# EAGLE design rfidLock3 (EAGLE 7.5.0)
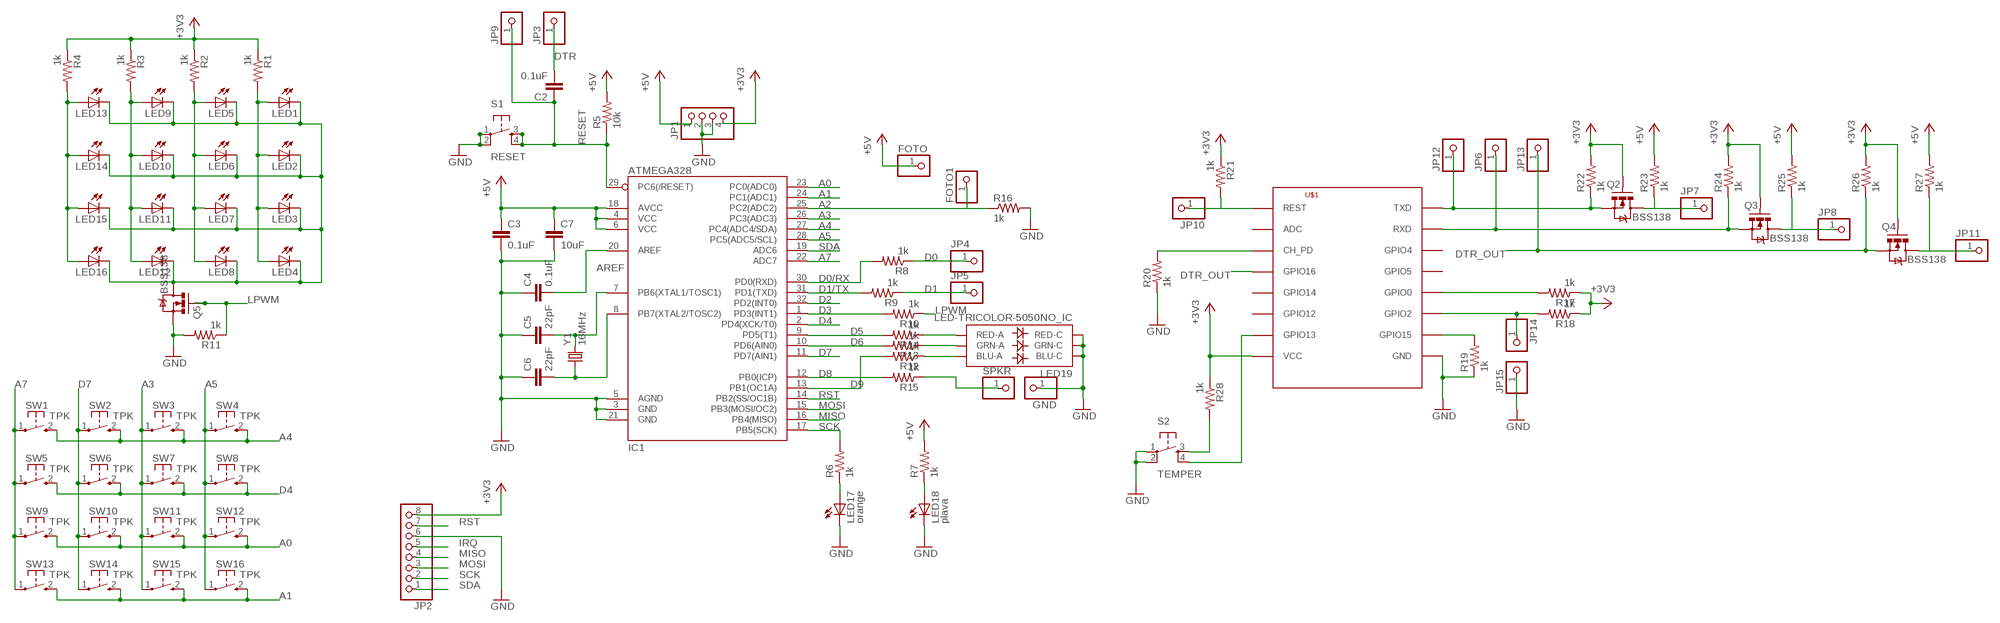
[diagram p0: schematic, sheet 1]

## Parts
C2  0.1uF  CAP0805  [0805]
C3  0.1uF  CAP0805  [0805]
C4  0.1uF  CAP0805  [0805]
C5  22pF  CAP0805  [0805]
C6  22pF  CAP0805  [0805]
C7  10uF  C-EUC3216  [C3216]
FOTO  PINHD-1X1  [1X01]
FOTO1  PINHD-1X1  [1X01]
GND  PINHD-1X1  [1X01]
IC1  ATMEGA328  ATMEGA168  [TQFP32-08]
JP1  PINHD-1X4  [1X04]
JP2  PINHD-1X8  [1X08]
JP3  PINHD-1X1  [1X01]
JP4  PINHD-1X1  [1X01]
JP5  PINHD-1X1  [1X01]
JP6  PINHD-1X1  [1X01]
JP7  PINHD-1X1  [1X01]
JP8  PINHD-1X1  [1X01]
JP9  PINHD-1X1  [1X01]
JP10  PINHD-1X1  [1X01]
JP11  PINHD-1X1  [1X01]
JP12  PINHD-1X1  [1X01]
JP13  PINHD-1X1  [1X01]
JP14  PINHD-1X1  [1X01]
JP15  PINHD-1X1  [1X01]
LED1  LED_E  [LED_1206]
LED2  LED_E  [LED_1206]
LED3  LED_E  [LED_1206]
LED4  LED_E  [LED_1206]
LED5  LED_E  [LED_1206]
LED6  LED_E  [LED_1206]
LED7  LED_E  [LED_1206]
LED8  LED_E  [LED_1206]
LED9  LED_E  [LED_1206]
LED10  LED_E  [LED_1206]
LED11  LED_E  [LED_1206]
LED12  LED_E  [LED_1206]
LED13  LED_E  [LED_1206]
LED14  LED_E  [LED_1206]
LED15  LED_E  [LED_1206]
LED16  LED_E  [LED_1206]
LED17  orange  LEDCHIP-LED0805  [CHIP-LED0805]
LED18  plava  LEDCHIP-LED0805  [CHIP-LED0805]
LED19  LED-TRICOLOR-5050NO_IC  [LED-TRICOLOR-5050]
Q2  BSS138  MOSFET-NCHANNELSMD  [SOT23-3]
Q3  BSS138  MOSFET-NCHANNELSMD  [SOT23-3]
Q4  BSS138  MOSFET-NCHANNELSMD  [SOT23-3]
Q5  BSS138  MOSFET-NCHANNELSMD  [SOT23-3]
R1  1k  RESISTOR0805-RES  [0805]
R2  1k  RESISTOR0805-RES  [0805]
R3  1k  RESISTOR0805-RES  [0805]
R4  1k  RESISTOR0805-RES  [0805]
R5  10k  RESISTOR0805-RES  [0805]
R6  1k  RESISTOR0805-RES  [0805]
R7  1k  RESISTOR0805-RES  [0805]
R8  1k  RESISTOR0805-RES  [0805]
R9  1k  RESISTOR0805-RES  [0805]
R10  1k  RESISTOR0805-RES  [0805]
R11  1k  RESISTOR0805-RES  [0805]
R12  1k  RESISTOR0805-RES  [0805]
R13  1k  RESISTOR0805-RES  [0805]
R14  1k  RESISTOR0805-RES  [0805]
R15  1k  RESISTOR0805-RES  [0805]
R16  1k  RESISTOR0805-RES  [0805]
R17  1k  RESISTOR0805-RES  [0805]
R18  1k  RESISTOR0805-RES  [0805]
R19  1k  RESISTOR0805-RES  [0805]
R20  1k  RESISTOR0805-RES  [0805]
R21  1k  RESISTOR0805-RES  [0805]
R22  1k  RESISTOR0805-RES  [0805]
R23  1k  RESISTOR0805-RES  [0805]
R24  1k  RESISTOR0805-RES  [0805]
R25  1k  RESISTOR0805-RES  [0805]
R26  1k  RESISTOR0805-RES  [0805]
R27  1k  RESISTOR0805-RES  [0805]
R28  1k  RESISTOR0805-RES  [0805]
S1  RESET  TAC_SWITCHSMD  [TACTILE_SWITCH_SMD]
S2  TEMPER  TAC_SWITCHSMD  [TACTILE_SWITCH_SMD]
SPKR  PINHD-1X1  [1X01]
SW1  TPK  KSS-2EG4430  [KSS-2EG4430]
SW2  TPK  KSS-2EG4430  [KSS-2EG4430]
SW3  TPK  KSS-2EG4430  [KSS-2EG4430]
SW4  TPK  KSS-2EG4430  [KSS-2EG4430]
SW5  TPK  KSS-2EG4430  [KSS-2EG4430]
SW6  TPK  KSS-2EG4430  [KSS-2EG4430]
SW7  TPK  KSS-2EG4430  [KSS-2EG4430]
SW8  TPK  KSS-2EG4430  [KSS-2EG4430]
SW9  TPK  KSS-2EG4430  [KSS-2EG4430]
SW10  TPK  KSS-2EG4430  [KSS-2EG4430]
SW11  TPK  KSS-2EG4430  [KSS-2EG4430]
SW12  TPK  KSS-2EG4430  [KSS-2EG4430]
SW13  TPK  KSS-2EG4430  [KSS-2EG4430]
SW14  TPK  KSS-2EG4430  [KSS-2EG4430]
SW15  TPK  KSS-2EG4430  [KSS-2EG4430]
SW16  TPK  KSS-2EG4430  [KSS-2EG4430]
U$1  ESP8266-07  [ESP-07]
Y1  16MHz  CRYSTAL5X3  [CRYSTAL-SMD-5X3]

## Nets
+3V3: JP1.4 JP2.8 Q2.1(G) Q3.1(G) Q4.1(G) R1.1 R2.1 R3.1 R4.1 R17.1 R18.1 R21.1 R22.2 R24.2 R26.2 R28.1 U$1.VCC
+5V: C3.1 C7.1 FOTO.1 IC1.4(VCC) IC1.6(VCC) IC1.18(AVCC) JP1.1 R5.2 R7.2 R23.2 R25.2 R27.2
A0: IC1.23(PC0(ADC0)) SW9.2(S) SW10.2(S) SW11.2(S) SW12.2(S)
A1: IC1.24(PC1(ADC1)) SW13.2(S) SW14.2(S) SW15.2(S) SW16.2(S)
A2: FOTO1.1 IC1.25(PC2(ADC2)) R16.1
A3: IC1.26(PC3(ADC3)) SW3.1(P) SW7.1(P) SW11.1(P) SW15.1(P)
A4: IC1.27(PC4(ADC4/SDA)) SW1.2(S) SW2.2(S) SW3.2(S) SW4.2(S)
A5: IC1.28(PC5(ADC5/SCL)) SW4.1(P) SW8.1(P) SW12.1(P) SW16.1(P)
A7: IC1.22(ADC7) SW1.1(P) SW5.1(P) SW9.1(P) SW13.1(P)
AREF: C4.2 IC1.20(AREF)
CRYSTAL1: C5.2 IC1.7(PB6(XTAL1/TOSC1)) Y1.3
CRYSTAL2: C6.2 IC1.8(PB7(XTAL2/TOSC2)) Y1.1
D0: JP4.1 R8.1
D0/RX: IC1.30(PD0(RXD)) R8.2
D1: JP5.1 R9.1
D1/TX: IC1.31(PD1(TXD)) R9.2
D2: IC1.32(PD2(INT0))
D3: IC1.1(PD3(INT1)) R10.2
D4: IC1.2(PD4(XCK/T0)) SW5.2(S) SW6.2(S) SW7.2(S) SW8.2(S)
D5: IC1.9(PD5(T1)) R14.2
D6: IC1.10(PD6(AIN0)) R13.2
D7: IC1.11(PD7(AIN1)) SW2.1(P) SW6.1(P) SW10.1(P) SW14.1(P)
D8: IC1.12(PB0(ICP)) R15.2
D9: IC1.13(PB1(OC1A)) R12.2
DTR: C2.2 JP3.1
DTR_OUT: JP13.1 Q4.2(S) R26.1 U$1.GPIO16
GND: C3.2 C4.1 C5.1 C6.1 C7.2 GND.1 IC1.3(GND) IC1.5(AGND) IC1.21(GND) JP1.2 JP1.3 JP2.6 JP15.1 LED17.C LED18.C LED19.4(BLU-C) LED19.5(RED-C) LED19.6(GRN-C) Q5.2(S) R11.2 R16.2 R19.1 R20.1 S1.1 S1.2 S2.1 S2.2 U$1.GND
HV1: JP7.1 Q2.3(D) R23.1
HV2: JP8.1 Q3.3(D) R25.1
HV3: JP11.1 Q4.3(D) R27.1
IRQ: JP2.5
LGND: LED1.C LED2.C LED3.C LED4.C LED5.C LED6.C LED7.C LED8.C LED9.C LED10.C LED11.C LED12.C LED13.C LED14.C LED15.C LED16.C Q5.3(D)
LPWM: Q5.1(G) R10.1 R11.1
LV1: JP12.1 Q2.2(S) R22.1 U$1.TXD
LV2: JP6.1 Q3.2(S) R24.1 U$1.RXD
MISO: IC1.16(PB4(MISO)) JP2.4
MOSI: IC1.15(PB3(MOSI/OC2)) JP2.3
N$1: LED9.A LED10.A LED11.A LED12.A R3.2
N$2: LED13.A LED14.A LED15.A LED16.A R4.2
N$3: LED5.A LED6.A LED7.A LED8.A R2.2
N$4: LED1.A LED2.A LED3.A LED4.A R1.2
N$5: LED17.A R6.1
N$6: LED19.1(GRN-A) R13.1
N$7: LED18.A R7.1
N$8: LED19.2(RED-A) R14.1
N$9: LED19.3(BLU-A) R12.1
N$10: R15.1 SPKR.1
N$11: R17.2 U$1.GPIO0
N$12: JP14.1 R18.2 U$1.GPIO2
N$13: R19.2 U$1.GPIO15
N$14: R20.2 U$1.CH_PD
N$15: JP10.1 R21.2 U$1.REST
N$20: R28.2 S2.3
N$21: S2.4 U$1.GPIO13
RESET: C2.1 IC1.29(PC6(/RESET)) JP9.1 R5.1 S1.3 S1.4
RST: IC1.14(PB2(SS/OC1B)) JP2.7
SCK: IC1.17(PB5(SCK)) JP2.2 R6.2
SDA: IC1.19(ADC6) JP2.1
Unconnected: U$1.ADC U$1.GPIO4 U$1.GPIO5 U$1.GPIO12 U$1.GPIO14

## Library data of the parts
C2-C6 = SparkFun:CAP: Capacitor Standard 0603 ceramic capacitor, and 0.1" leaded capacitor.
C7 = rcl:C-EU: CAPACITOR, European symbol
FOTO FOTO1 GND JP3-JP15 SPKR = pinhead:PINHD-1X1: PIN HEADER
IC1 = SparkFun:ATMEGA168
JP1 = pinhead:PINHD-1X4: PIN HEADER
JP2 = pinhead:PINHD-1X8: PIN HEADER
LED1-LED16 = eagle-ltspice:LED_E: LED Source: http://www.osram.convergy.de Source: www.luxeon.com Source: www.kingbright.com; SPICEMODEL: NONE; SPICEPREFIX: D; SPICETYPE: diode
LED17 LED18 = adafruit:LED: LED OSRAM: - CHIPLED LG R971, LG N971, LY N971, LG Q971, LY Q971, LO R971, LY R971 LH N974, LH R974 LS Q976, LO Q976, LY Q976 LO Q996 - Hyper CHIPLED LW Q18S LB Q993, LB Q99A, LB R99A - SideLED LS A670, LO A670, LY A670, LG A670, LP A670 LB A673, LV A673, LT A673, LW A673 LH A674 LY A675 LS A676, LA A676, LO A676, LY A676, LW A676 LS A679, LY A679, LG A679 - Hyper Micro SIDELED® LS Y876, LA Y876, LO Y876, LY Y876 LT Y87S - SmartLED LW L88C, LW L88S LB L89C, LB L89S, LG L890 LS L89K, LO L89K, LY L89K LS L896, LA L896, LO L896, LY L896 - TOPLED LS T670, LO T670, LY T670, LG T670, LP T670 LSG T670, LSP T670, LSY T670, LOP T670, LYG T670 LG T671, LOG T671, LSG T671 LB T673, LV T673, LT T673, LW T673 LH T674 LS T676, LA T676, LO T676, LY T676, LB T676, LH T676, LSB T676, LW T676 LB T67C, LV T67C, LT T67C, LS T67K, LO T67K, LY T67K, LW E67C LS E67B, LA E67B, LO E67B, LY E67B, LB E67C, LV E67C, LT E67C LW T67C LS T679, LY T679, LG T679 LS T770, LO T770, LY T770, LG T770, LP T770 LB T773, LV T773, LT T773, LW T773 LH T774 LS E675, LA E675, LY E675, LS T675 LS T776, LA T776, LO T776, LY T776, LB T776 LHGB T686 LT T68C, LB T68C - Hyper Mini TOPLED® LB M676 - Mini TOPLED Santana® LG M470 LS M47K, LO M47K, LY M47K Source: http://www.osram.convergy.de/
LED19 = SparkFun-LED:LED-TRICOLOR-5050
Q2-Q5 = SparkFun:MOSFET-NCHANNEL
R1-R28 = SparkFun:RESISTOR: Resistor Basic schematic elements and footprints for 0603, 1206, and PTH resistors.
S1 S2 = SparkFun:TAC_SWITCH: Momentary Switch Button commonly used for reset or general input. Spark Fun Electronics SKU : COM-00097
SW1-SW16 = buttons:KSS-2EG4430: Size: 3x6mm Height: 5mm from PCB Rating: DC12v 50mA Travel: 0.25±0.10mm Operating Force: 180±50gf Return Force: 60gf min Contact resistance: 100m? max Insulation resistance: 100M? min Operating life?50,000 cycles
U$1 = lio:ESP8266
Y1 = SparkFun:CRYSTAL: Crystals Various standard crystals. Proven footprints. Spark Fun Electronics SKU : COM-00534

## Net classes
1 vcc: width 0.254 mm

## Board
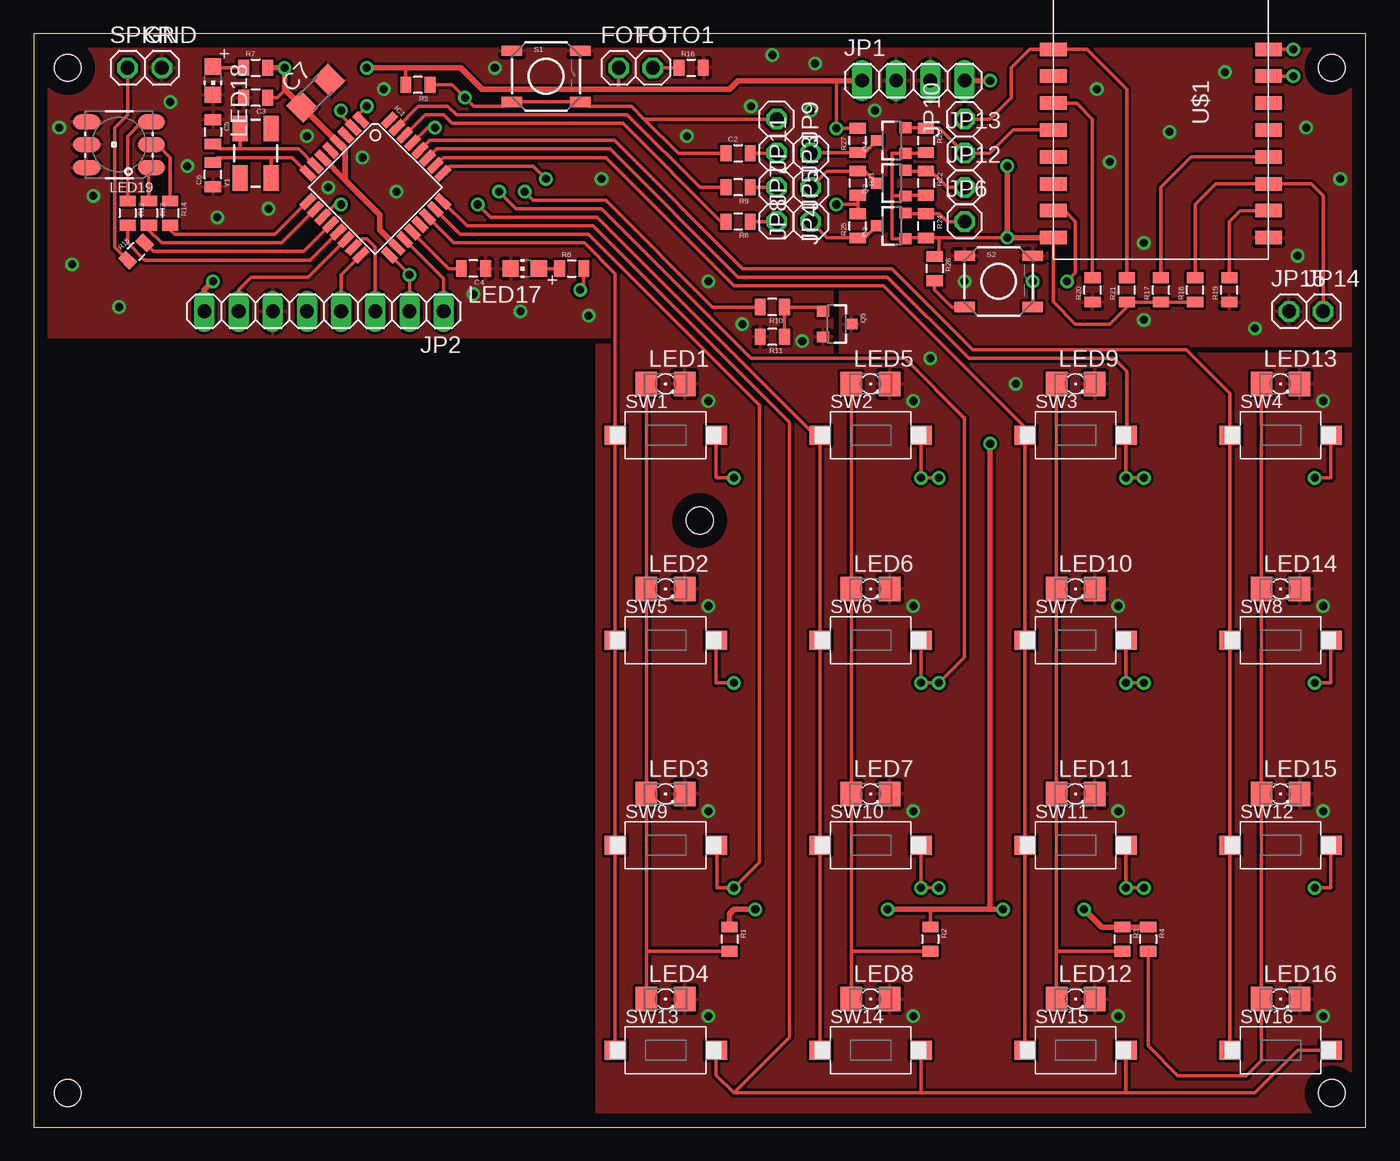
[diagram p1: board, top side]
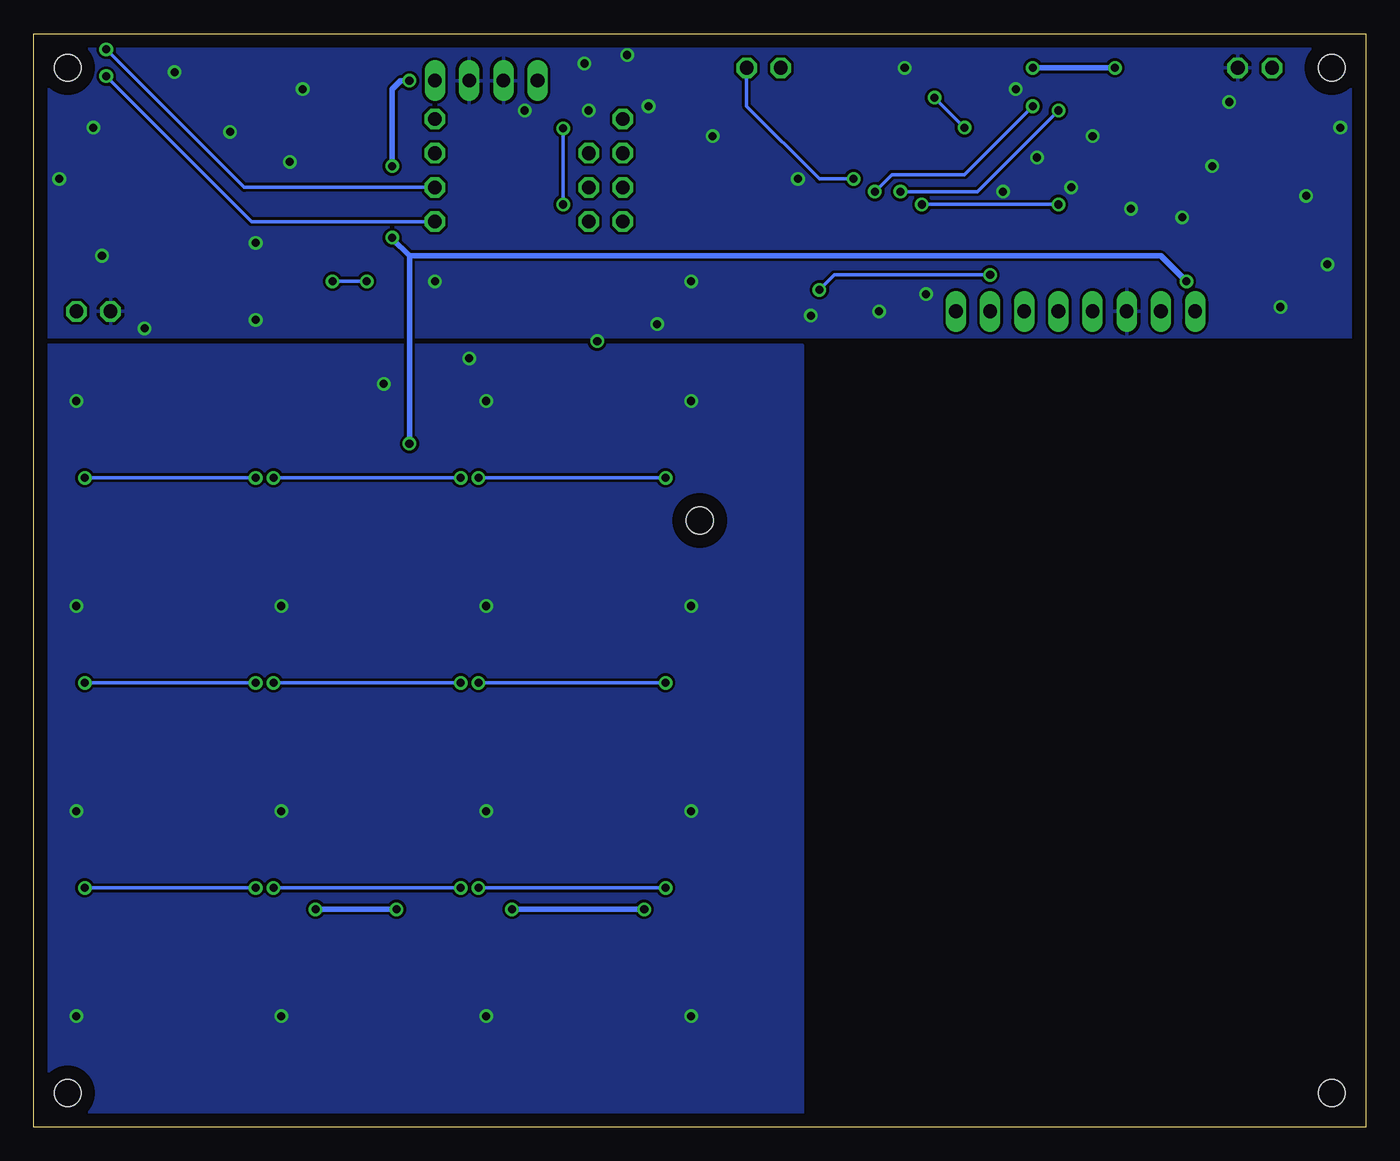
[diagram p2: board, bottom side, seen from below]

Size 99.06 x 81.28 mm. Coordinates in mm from the lower left corner, seen from the top.
Outline: 0,0 99.06,0 99.06,81.28 0,81.28 0,0
Copper layers (1*16): Top 0.035mm / dielectric 1.5mm / Bottom 0.035mm
Design rules "default": minimum track width 10mil, minimum drill 24mil, track to track 8mil, track to pad 8mil, pad to pad 8mil, via to via 8mil, smd to smd 8mil, copper to edge 40mil, drill to drill 8mil, minimum pad ring 10mil, minimum via ring 8mil, stop-mask expansion 4mil, vias tented up to drill 0mil, thermal gap 10mil
Holes 2 mm at 2.54,78.74 96.52,78.74 96.52,2.54 2.54,2.54 49.53,45.09

### Footprints (pad centres in the part's own frame; a part is rotated, then mirrored left to right if it is on the bottom)
0805 = smd 0.8 x 1.2: 1 -0.9,0; 2 0.9,0
C3216 = smd 1.6 x 1.8: 1 -1.4,0; 2 1.4,0
1X01 = drill 1.016 octagon: 1 0,0
TQFP32-08 = smd 1.27 x 0.559: 1 -4.293,2.8; 2 -4.293,2; 3 -4.293,1.2; 4 -4.293,0.4; 5 -4.293,-0.4; 6 -4.293,-1.2; 7 -4.293,-2; 8 -4.293,-2.8; 17 4.293,-2.8; 18 4.293,-2; 19 4.293,-1.2; 20 4.293,-0.4; 21 4.293,0.4; 22 4.293,1.2; 23 4.293,2; 24 4.293,2.8 | smd 0.559 x 1.27: 9 -2.8,-4.293; 10 -2,-4.293; 11 -1.2,-4.293; 12 -0.4,-4.293; 13 0.4,-4.293; 14 1.2,-4.293; 15 2,-4.293; 16 2.8,-4.293; 25 2.8,4.293; 26 2,4.293; 27 1.2,4.293; 28 0.4,4.293; 29 -0.4,4.293; 30 -1.2,4.293; 31 -2,4.293; 32 -2.8,4.293
1X04 = drill 1.016 long: 1 -3.81,0; 2 -1.27,0; 3 1.27,0; 4 3.81,0
1X08 = drill 1.016 long: 1 -8.89,0; 2 -6.35,0; 3 -3.81,0; 4 -1.27,0; 5 1.27,0; 6 3.81,0; 7 6.35,0; 8 8.89,0
LED_1206 = smd 1.6 x 1.803: A -1.422,0; C 1.422,0
CHIP-LED0805 = smd 1.2 x 1.2: A 0,-1.05; C 0,1.05
LED-TRICOLOR-5050 = smd 2 x 1.1: 1 -2.4,1.7; 2 -2.4,0; 3 -2.4,-1.7; 4 2.4,-1.7; 5 2.4,0; 6 2.4,1.7
SOT23-3 = smd 0.8 x 0.9: 1 -0.95,-1; 2 0.95,-1; 3 0,1.1
TACTILE_SWITCH_SMD = smd 1.524 x 0.762: 1 -2.54,1.905; 2 2.54,1.905; 3 -2.54,-1.905; 4 2.54,-1.905
KSS-2EG4430 = smd 1.6 x 1.4: 1 -3.75,0; 2 3.75,0
ESP-07 = smd 1 x 2: ADC -1.6,-8; CH_PD 0.4,-8; GND 10.4,8; GPIO0 4.4,8; GPIO2 6.4,8; GPIO4 0.4,8; GPIO5 2.4,8; GPIO12 6.4,-8; GPIO13 8.4,-8; GPIO14 4.4,-8; GPIO15 8.4,8; GPIO16 2.4,-8; REST -3.6,-8; RXD -1.6,8; TXD -3.6,8; VCC 10.4,-8
CRYSTAL-SMD-5X3 = smd 1.9 x 1.1: 1 -1.85,-1.15; 2 1.85,-1.15; 3 1.85,1.15; 4 -1.85,1.15

### Placement (x,y rotation side)
C2  52.39,72.39 0 top
C3  16.51,76.52 180 top
C4  32.7,63.82 180 top
C5  13.34,73.98 270 top
C6  13.34,70.8 90 top
C7  20.95,76.83 45 top
FOTO  43.5,78.74 0 top
FOTO1  46.04,78.74 0 top
GND  9.53,78.74 0 top
IC1  25.4,69.85 315 top
JP1  65.41,77.79 0 top
JP2  21.59,60.64 180 top
JP3  55.24,72.39 270 top
JP4  55.24,67.31 270 top
JP5  55.24,69.85 270 top
JP6  69.22,67.31 0 top
JP7  57.78,69.85 90 top
JP8  57.78,67.31 90 top
JP9  55.24,74.93 270 top
JP10  69.22,74.93 90 top
JP11  57.78,72.39 90 top
JP12  69.22,69.85 0 top
JP13  69.22,72.39 0 top
JP14  95.89,60.64 0 top
JP15  93.34,60.64 0 top
LED1  46.99,55.24 0 top
LED2  46.99,40.01 0 top
LED3  46.99,24.77 0 top
LED4  46.99,9.53 0 top
LED5  62.23,55.24 0 top
LED6  62.23,40.01 0 top
LED7  62.23,24.77 0 top
LED8  62.23,9.53 0 top
LED9  77.47,55.24 0 top
LED10  77.47,40.01 0 top
LED11  77.47,24.77 0 top
LED12  77.47,9.53 0 top
LED13  92.71,55.24 0 top
LED14  92.71,40.01 0 top
LED15  92.71,24.77 0 top
LED16  92.71,9.53 0 top
LED17  36.51,63.82 90 top
LED18  13.34,77.79 180 top
LED19  6.35,73.03 180 top
Q2  63.82,70.17 90 top
Q3  63.82,66.99 90 top
Q4  63.82,73.34 90 top
Q5  59.69,59.69 270 top
R1  51.75,13.97 270 top
R2  66.67,13.97 270 top
R3  80.96,13.97 270 top
R4  82.87,13.97 270 top
R5  28.57,77.47 180 top
R6  40.01,63.82 0 top
R7  16.51,78.74 0 top
R8  52.39,67.31 180 top
R9  52.39,69.85 180 top
R10  54.93,60.96 180 top
R11  54.93,58.74 180 top
R12  6.99,67.94 270 top
R13  8.57,67.94 270 top
R14  10.16,67.94 270 top
R15  7.62,65.09 45 top
R16  48.9,78.74 0 top
R17  83.82,62.23 90 top
R18  86.36,62.23 90 top
R19  88.9,62.23 90 top
R20  78.74,62.23 90 top
R21  81.28,62.23 90 top
R22  66.36,70.17 270 top
R23  61.28,70.17 270 top
R24  66.36,66.99 270 top
R25  61.28,66.99 90 top
R26  66.36,73.34 270 top
R27  61.28,73.34 90 top
R28  66.99,63.82 270 top
S1  38.1,78.11 0 top
S2  71.75,62.87 0 top
SPKR  6.99,78.74 0 top
SW1  46.99,51.44 0 top
SW2  62.23,51.44 0 top
SW3  77.47,51.44 0 top
SW4  92.71,51.44 0 top
SW5  46.99,36.2 0 top
SW6  62.23,36.2 0 top
SW7  77.47,36.2 0 top
SW8  92.71,36.2 0 top
SW9  46.99,20.95 0 top
SW10  62.23,20.95 0 top
SW11  77.47,20.95 0 top
SW12  92.71,20.95 0 top
SW13  46.99,5.71 0 top
SW14  62.23,5.71 0 top
SW15  77.47,5.71 0 top
SW16  92.71,5.71 0 top
U$1  83.82,76.52 270 top
Y1  16.51,72.39 90 top

### Tracks (layer width: path | path; a pad name or v marks a point on that pad's centre or on a via)
+3V3  (via drill 0.6)
  Top 0.254: R2.1 66.67,16.19 | R18.1 R17.1 R21.1 81.28,60.96 80.01,59.69 77.47,59.69 75.82,61.34 U$1.VCC | R22.2 64.82,69.27 Q2.1 63.82,69.22 | 63.82,69.22 63.82,66.04 Q3.1 64.82,66.09 R24.2 66.36,66.12 67.31,66.12 | 63.82,69.22 63.82,72.39 Q4.1 66.36,72.39 R26.2 | v72.39,66.12 67.31,66.12 | R28.1 67.31,64.72 67.31,66.12
  Top 0.406: v78.11,16.19 79.43,14.87 R3.1 R4.1 | v63.5,16.19 66.67,16.19 71.12,16.19 | v72.07,16.19 71.12,16.19 | JP2.8 12.7,62.23 v13.34,62.87 | v71.12,50.8 71.12,16.19 | R1.1 51.75,15.88 52.07,16.19 v53.66,16.19 | v71.12,77.79 JP1.4 | v72.39,71.44 v72.39,66.12 U$1.VCC
  Bottom 0.406: v53.66,16.19 v63.5,16.19 | v72.07,16.19 v78.11,16.19 | v13.34,62.87 15.24,64.77 71.12,64.77 | v71.12,77.79 71.75,77.79 72.39,77.15 v72.39,71.44 | 71.12,64.77 72.39,66.04 v72.39,66.12 | v71.12,50.8 71.12,64.77
+5V  (via drill 0.6)
  Top 0.254: C3.1 18.1,76.52 18.7,77.11 | R5.2 27.68,78.74 | FOTO.1 43.5,77.15 | R25.2 61.28,68.58 | JP1.1 59.69,77.79 v59.69,74.24 R27.2 | 61.28,68.58 R23.2 | 61.28,68.58 v59.69,68.58
  Top 0.406: 23.18,70.38 23.18,72.64 IC1.4 C7.1 | IC1.6 23.18,70.38 | 19.34,76.48 C7.1 | C7.1 18.7,77.11 18.66,77.15 v18.66,78.74 R7.2 | v24.77,78.74 27.68,78.74 31.75,78.74 33.34,77.15 43.5,77.15 51.75,77.15 52.39,77.79 JP1.1 | 23.18,70.38 25.72,67.83 25.72,66.7 IC1.18
  Bottom 0.254: v59.69,74.24 v59.69,68.58
  Bottom 0.406: v24.77,78.74 v18.66,78.74
A0  (via drill 0.6)
  Top 0.254: IC1.23 31.72,66.36 41.27,66.36 53.98,53.66 53.98,19.68 v52.07,17.78 50.8,17.78 50.8,20.95 SW9.2 | SW11.2 v81.22,17.78 v82.55,17.78 | SW12.2 96.46,17.78 v95.25,17.78 | v67.31,17.78 v65.98,17.78 SW10.2
  Bottom 0.254: v95.25,17.78 v82.55,17.78 | v81.22,17.78 v67.31,17.78 | v65.98,17.78 v52.07,17.78
A1
  Top 0.254: IC1.24 32.22,66.99 41.59,66.99 56.2,52.39 56.2,6.67 52.07,2.54 | 52.07,2.54 50.74,3.87 SW13.2 | SW14.2 65.98,2.54 | SW15.2 81.22,2.54 | 52.07,2.54 65.98,2.54 | 65.98,2.54 81.22,2.54 | 81.22,2.54 90.81,2.54 93.98,5.71 SW16.2
A2  (via drill 0.6)
  Top 0.254: IC1.25 30.95,71.44 37.15,71.44 v38.1,70.48 | FOTO1.1 R16.1
  Bottom 0.254: v38.1,70.48 40.64,70.48 46.04,75.88 FOTO1.1
A3
  Top 0.254: IC1.26 30.45,72.07 42.55,72.07 52.07,62.55 63.18,62.55 73.72,52.01 SW3.1 | SW3.1 SW7.1 SW11.1 73.72,6.41 73.66,6.35 73.66,5.78 SW15.1 | 73.34,51.44 SW3.1
A4  (via drill 0.6)
  Top 0.254: IC1.27 29.95,72.71 42.86,72.71 52.39,63.18 63.5,63.18 69.53,57.15 80.33,57.15 81.28,56.2 81.28,51.49 SW3.2 v81.22,48.26 v82.55,48.26 | SW1.2 50.74,48.32 50.8,48.26 v52.07,48.26 | SW2.2 v65.98,48.26 v67.31,48.26 | SW4.2 96.46,48.26 v95.25,48.26
  Bottom 0.254: v82.55,48.26 v95.25,48.26 | v52.07,48.26 v65.98,48.26 | v67.31,48.26 v81.22,48.26
A5
  Top 0.254: IC1.28 29.46,73.34 43.18,73.34 52.7,63.82 63.82,63.82 69.85,57.78 85.72,57.78 88.96,54.55 SW4.1 SW8.1 SW12.1 SW16.1
A7
  Top 0.254: SW13.1 SW9.1 SW5.1 SW1.1 43.24,63.44 40.96,65.72 31.23,65.72 IC1.22
AREF
  Top 0.254: IC1.20 30.87,63.82 C4.2
CRYSTAL1
  Top 0.254: C5.2 13.71,72.71 15.36,72.71 | IC1.7 19.71,72.71 16.51,72.71 15.36,72.71 | Y1.3 15.36,72.71
CRYSTAL2
  Top 0.254: IC1.8 19.22,72.07 19.05,72.07 17.66,72.07 | 17.66,72.07 13.65,72.07 13.34,71.75 C6.2 | Y1.1 17.66,72.07
D0
  Top 0.254: R8.1 JP4.1
D0/RX
  Top 0.254: IC1.30 29.1,75.25 30.48,75.25 31.11,74.61 43.81,74.61 51.12,67.31 R8.2
D1
  Top 0.254: R9.1 JP5.1
D1/TX
  Top 0.254: IC1.31 28.6,75.88 30.8,75.88 31.43,75.25 44.13,75.25 49.53,69.85 R9.2
D3  (via drill 0.6)
  Top 0.254: IC1.1 24.07,75.18 v24.77,75.88 | v36.51,69.53 37.15,68.9 42.55,68.9 50.48,60.96 R10.2
  Bottom 0.254: v24.77,75.88 29.84,70.8 35.24,70.8 v36.51,69.53
D4  (via drill 0.6)
  Top 0.254: SW5.2 50.74,33.02 v52.07,33.02 | SW6.2 v65.98,33.02 v67.31,33.02 69.22,34.92 69.22,52.7 64.77,57.15 53.34,57.15 42.23,68.26 35.88,68.26 v34.61,69.53 | SW7.2 v81.22,33.02 v82.55,33.02 | SW8.2 96.46,33.02 v95.25,33.02 | IC1.2 22.83,75.25 v22.86,75.56
  Bottom 0.254: v95.25,33.02 v82.55,33.02 | v81.22,33.02 v67.31,33.02 | v65.98,33.02 v52.07,33.02 | v22.86,75.56 28.89,69.53 v34.61,69.53
D5
  Top 0.254: IC1.9 20.39,68.83 17.91,66.36 10.48,66.36 10.16,66.67 R14.2
D6
  Top 0.254: IC1.10 18.44,65.72 9.53,65.72 8.57,66.67 R13.2
D7  (via drill 0.6)
  Top 0.254: SW14.1 SW10.1 SW6.1 SW2.1 58.1,51.44 41.91,67.63 33.97,67.63 v33.02,68.58 | IC1.11 22.43,68.58 v22.86,68.58
  Bottom 0.254: v33.02,68.58 v22.86,68.58
D8
  Top 0.254: IC1.12 20.07,65.09 8.89,65.09 R15.2
D9
  Top 0.254: IC1.13 20.57,64.45 8.26,64.45 6.99,65.72 R12.2
DTR
  Top 0.254: C2.2 JP3.1
DTR_OUT
  Top 0.254: Q4.2 66.36,74.29 R26.1 67.36,74.24 JP13.1 71.12,72.39 72.85,74.12 U$1.GPIO16
GND  (via drill 0.6)
  other vias: 4.45,69.22 6.35,60.96 13.65,67.63 10.16,76.2 36.2,60.64 41.27,60.33 52.7,59.69 57.15,58.42 57.78,75.56 34.29,78.74 11.43,71.44 17.46,68.26 20.32,73.66 26.04,77.15 42.23,70.48 48.58,73.66 53.34,75.88 54.93,79.69 62.55,75.56 79.06,77.15 88.58,78.42 80.01,71.75 84.45,73.98 82.55,65.72 97.16,70.48 32.7,61.91 94.61,74.3 93.98,64.77 90.81,59.37 58.1,79.06 1.91,74.3 2.86,64.14 24.45,72.07 26.99,69.53 21.91,69.85 82.55,60.01 69.22,62.87 50.16,62.87
  pour Top: 0,81.28 99.06,81.28 99.06,58.1 67.94,58.1 63.18,62.87 59.37,62.87 59.37,57.47 53.34,57.47 46.99,63.82 42.55,63.82 43.18,63.18 43.18,58.74 0,58.74
  pour Bottom: 0,58.74 99.06,58.74 99.06,81.28 0,81.28
HV1
  Top 0.254: Q2.3 61.82,71.07 R23.1 59,71.07 JP7.1
HV2
  Top 0.254: Q3.3 61.82,66.09 R25.1 59,66.09 JP8.1
HV3
  Top 0.254: Q4.3 61.82,72.44 R27.1 57.84,72.44 JP11.1
LGND  (via drill 0.6)
  other vias: 50.16,53.98 50.16,38.73 50.16,23.5 50.16,8.26 65.41,8.26 65.41,23.5 65.41,38.73 65.41,53.98 73.03,55.24 95.89,53.98 95.89,38.73 95.89,23.5 95.89,8.26 66.67,57.15 80.64,38.73 80.64,23.5 80.64,8.26
  pour Top: 41.91,0 99.06,0 99.06,57.47 67.94,57.47 63.18,62.23 60.01,62.23 60.01,56.83 53.34,56.83 46.67,63.5 43.5,63.5 43.5,58.1 41.91,58.1
  pour Bottom: 41.91,58.1 99.06,58.1 99.06,0 41.91,0
LPWM
  Top 0.254: R11.1 R10.1 58.37,60.96 Q5.1
LV1  (via drill 0.6)
  Top 0.254: Q2.2 64.82,71.07 R22.1 66.73,71.07 67.94,69.85 JP12.1 | U$1.TXD v93.66,80.12
  Bottom 0.254: JP12.1 83.39,69.85 v93.66,80.12
LV2  (via drill 0.6)
  Top 0.254: Q3.2 64.82,67.89 R24.1 67.36,67.89 67.94,67.31 JP6.1 | U$1.RXD v93.66,78.12
  Bottom 0.254: JP6.1 82.86,67.31 v93.66,78.12
MISO
  Top 0.254: IC1.16 22.86,63.35 JP2.4
MOSI
  Top 0.254: IC1.15 24.42,66.04 24.77,66.04 25.4,65.41 JP2.3
N$1
  Top 0.254: LED9.A LED10.A LED11.A 76.05,13.07 | 76.05,13.07 LED12.A | R3.2 76.05,13.07
N$2
  Top 0.254: LED13.A LED14.A 91.44,39.85 91.44,39.37 91.29,39.22 LED15.A LED16.A 91.29,4.93 90.17,3.81 85.09,3.81 82.87,6.03 R4.2
N$3
  Top 0.254: LED6.A LED7.A 60.81,13.07 | LED6.A 60.83,40.01 | 60.81,13.07 LED8.A | LED6.A LED5.A | R2.2 60.81,13.07
N$4
  Top 0.254: 45.57,13.07 LED3.A LED2.A LED1.A 45.59,55.24 | 45.57,13.07 LED4.A | R1.2 45.57,13.07
N$5
  Top 0.254: LED17.A R6.1
N$6
  Top 0.254: R13.1 8.57,71.15 LED19.1
N$7
  Top 0.254: R7.1 13.34,78.74 LED18.A
N$8
  Top 0.254: R14.1 10.16,72.07 9.21,73.03 LED19.2
N$9
  Top 0.254: R12.1 6.99,73.66 8.05,74.72 LED19.3
N$10
  Top 0.254: R15.1 6.03,65.4 6.03,74.3 6.99,75.25 SPKR.1
N$11
  Top 0.254: R17.2 83.82,69.85 86.09,72.12 U$1.GPIO0
N$12
  Top 0.254: R18.2 86.36,68.58 87.9,70.12 U$1.GPIO2 94.98,70.12 95.89,69.22 JP14.1
N$13
  Top 0.254: R19.2 88.9,67.31 89.71,68.12 U$1.GPIO15
N$14
  Top 0.254: R20.2 78.74,74.93 77.55,76.12 U$1.CH_PD
N$15
  Top 0.254: JP10.1 71.12,74.93 72.71,76.52 72.71,78.74 74.08,80.12 U$1.REST 78.31,80.12 81.28,77.15 R21.2
N$16  (via drill 0.6)
  other vias: 96.52,2.54
N$17  (via drill 0.6)
  other vias: 49.53,45.09
N$18  (via drill 0.6)
  other vias: 2.54,78.74
N$19  (via drill 0.6)
  other vias: 96.52,78.74
N$20
  Top 0.254: R28.2 66.99,62.23 68.26,60.96 S2.3
N$21  (via drill 0.6)
  Top 0.254: U$1.GPIO13 76.66,68.12 77.47,67.31 77.47,63.5 v76.83,62.87 | S2.4 v74.3,62.87
  Bottom 0.254: v74.3,62.87 76.2,62.87 v76.83,62.87
N$22  (via drill 0.6)
  other vias: 2.54,2.54
RESET  (via drill 0.6)
  Top 0.254: IC1.29 29.28,74.3 v29.84,74.3 | C2.1 47.94,72.39 45.4,74.93 | 45.4,74.93 44.45,75.88 41.27,75.88 40.96,76.2 S1.4 S1.3 35.24,76.2 34.92,75.88 32.7,75.88 v32.07,76.52 31.11,77.47 R5.1 | 45.4,74.93 JP9.1
  Bottom 0.254: v29.84,74.3 v32.07,76.52
RST
  Top 0.254: IC1.14 20.43,63.18 16.19,63.18 15.24,62.23 JP2.7
SCK  (via drill 0.6)
  Top 0.254: IC1.17 v27.94,63.35 JP2.2 | R6.2 40.91,62.49 v40.64,62.23
  Bottom 0.254: v40.64,62.23 39.52,63.35 v27.94,63.35
SDA
  Top 0.254: IC1.19 30.48,63.07 JP2.1